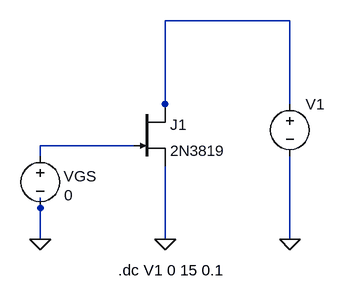
[diagram p0: schematic 2N3819.asc]
2N3819.asc, the LTspice schematic file:
Version 4.1
SHEET 1 880 680
WIRE 528 -256 336 -256
WIRE 336 -128 336 -256
WIRE 528 -128 528 -256
WIRE 336 -112 336 -128
WIRE 288 -64 144 -64
WIRE 144 -48 144 -64
WIRE 144 32 144 16
WIRE 144 80 144 32
WIRE 336 80 336 -32
WIRE 528 80 528 -48
FLAG 144 80 0
FLAG 528 80 0
FLAG 336 80 0
SYMBOL njf 288 -128 R0
SYMATTR InstName J1
SYMATTR Value 2N3819
SYMBOL voltage 144 -64 R0
WINDOW 0 36 47 Left 2
WINDOW 3 37 76 Left 2
WINDOW 123 0 0 Left 0
WINDOW 39 0 0 Left 0
SYMATTR InstName VGS
SYMATTR Value 0
SYMBOL voltage 528 -144 R0
SYMATTR InstName V1
SYMATTR Value ""
TEXT 264 128 Left 2 !.dc V1 0 15 0.1

The netlist it stands for:
* 2N3819.asc
J1 N001 N002 0 2N3819
VGS N002 0 0
V1 N001 0
.model NJF NJF
.model PJF PJF
.lib standard.jft
.dc V1 0 15 0.1
.backanno
.end